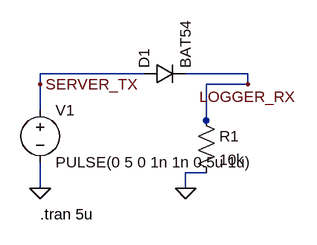
[diagram p0: schematic DataDiode.asc]
DataDiode.asc, the LTspice schematic file:
Version 4.1
SHEET 1 880 680
WIRE 32 144 -128 144
WIRE 192 144 96 144
WIRE -128 160 -128 144
WIRE 192 160 192 144
WIRE 192 160 128 160
WIRE -128 200 -128 160
WIRE 128 216 128 160
WIRE 128 224 128 216
WIRE 128 296 96 296
WIRE -128 320 -128 280
WIRE 96 320 96 296
FLAG -128 320 0
FLAG 96 320 0
FLAG -128 160 SERVER_TX
FLAG 192 160 LOGGER_RX
SYMBOL voltage -128 184 R0
WINDOW 123 0 0 Left 0
WINDOW 39 0 0 Left 0
SYMATTR InstName V1
SYMATTR Value PULSE(0 5 0 1n 1n 0.5u 1u)
SYMBOL diode 32 160 R270
SYMATTR InstName D1
SYMATTR Value BAT54
SYMBOL res 112 200 R0
SYMATTR InstName R1
SYMATTR Value 10k
TEXT -128 360 Left 2 !.tran 5u

The netlist it stands for:
* DataDiode.asc
V1 SERVER_TX 0 PULSE(0 5 0 1n 1n 0.5u 1u)
D1 SERVER_TX LOGGER_RX BAT54
R1 LOGGER_RX 0 10k
.model D D
.lib standard.dio
.tran 5u
.backanno
.end